# Altium project 蓝牙板.PrjPCB
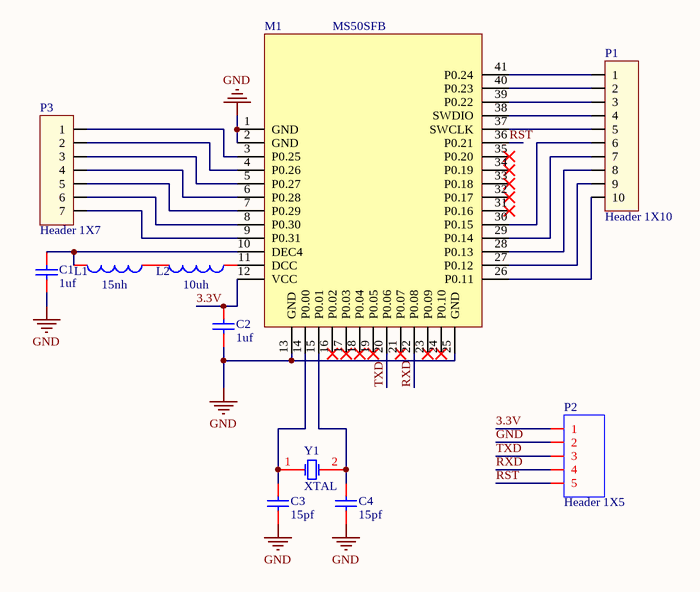
[diagram p0: 蓝牙板.SchDoc]
1 sheet, 11 parts. Net scope: global (net labels, ports and power ports of the same name join across sheets).
Board file: 蓝牙板.PcbDoc

## Sheet 蓝牙板.SchDoc
size A4

### Parts
C1  1uf  [CAP[0603]]
C2  1uf  [CAP[0603]]
C3  15pf  [CAP[0603]]
C4  15pf  [CAP[0603]]
L1  15nh  [0603_L]
L2  10uh  [0603_L]
M1  MS50SFB  [MS50SFB_V3.0]
P1  Header 1X10  [HEADER 1X10]
P2  Header 1X5  [HEADER 1X5]
P3  Header 1X7  [HEADER 1X7]
Y1  XTAL  [XTAL-3215]

### Nets
GND: C1.1 C2.1 C3.1 C4.1 M1.1(GND) M1.2(GND) M1.13(GND) M1.25(GND) P2.2
3.3V: C2.2 M1.12(VCC) P2.1
RST: M1.36(P0.21) P2.5
RXD: M1.22(P0.08) P2.4
TXD: M1.20(P0.06) P2.3
NetC1_2: C1.2 L1.2 M1.10(DEC4)
NetC3_2: C3.2 M1.14(P0.00) Y1.1(OSC1)
NetC4_2: C4.2 M1.15(P0.01) Y1.2(OSC2)
NetL1_1: L1.1 L2.2
NetL2_1: L2.1 M1.11(DCC)
NetM1_3: M1.3(P0.25) P3.1
NetM1_4: M1.4(P0.26) P3.2
NetM1_5: M1.5(P0.27) P3.3
NetM1_6: M1.6(P0.28) P3.4
NetM1_7: M1.7(P0.29) P3.5
NetM1_8: M1.8(P0.30) P3.6
NetM1_9: M1.9(P0.31) P3.7
NetM1_26: M1.26(P0.11) P1.10
NetM1_27: M1.27(P0.12) P1.9
NetM1_28: M1.28(P0.13) P1.8
NetM1_29: M1.29(P0.14) P1.7
NetM1_30: M1.30(P0.15) P1.6
NetM1_37: M1.37(SWCLK) P1.5
NetM1_38: M1.38(SWDIO) P1.4
NetM1_39: M1.39(P0.22) P1.3
NetM1_40: M1.40(P0.23) P1.2
NetM1_41: M1.41(P0.24) P1.1

Not connected (* = marked no-connect by the designer): M1 16(P0.02)* 17(P0.03)* 18(P0.04)* 19(P0.05)* 21(P0.07)* 23(P0.09)* 24(P0.10)* 31(P0.16)* 32(P0.17)* 33(P0.18)* 34(P0.19)* 35(P0.20)*

### Library data of the parts
C1-C4 = Cap
L1 L2 = inductor
M1 = MS50SFB_V3.0